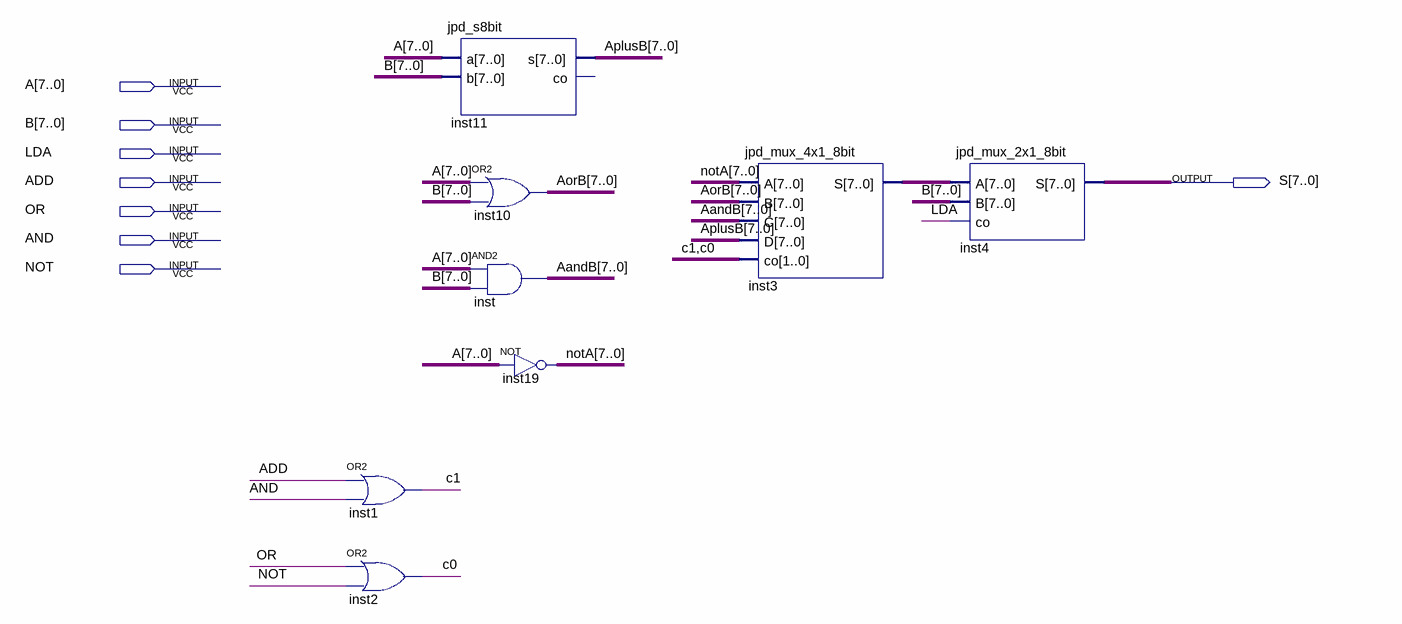
[diagram p0: schematic sheet]
// Quartus schematic jpd_ula_neander.bdf as structural Verilog: 8 symbols, 8 pins
module jpd_ula_neander (
  input  [7:0] A,
  input  [7:0] B,
  input  LDA,
  input  ADD,
  input  OR,
  input  AND,
  input  NOT,
  output [7:0] S
);

  wire c0, c1;
  wire [7:0] AandB, AorB, AplusB, inst3_s, notA;

  or inst1 (c1, ADD, AND);
  or inst2 (c0, OR, NOT);
  jpd_s8bit inst11 (.a(A), .b(B), .s(AplusB));  // open: co
  assign AorB = A | B;  // OR2 inst10, 8 bits wide
  assign AandB = A & B;  // AND2 inst, 8 bits wide
  assign notA = ~A;  // NOT inst19, 8 bits wide
  jpd_mux_4x1_8bit inst3 (.A(notA), .B(AorB), .C(AandB), .D(AplusB), .co({c1, c0}), .S(inst3_s));
  jpd_mux_2x1_8bit inst4 (.A(inst3_s), .B(B), .co(LDA), .S(S));
endmodule
